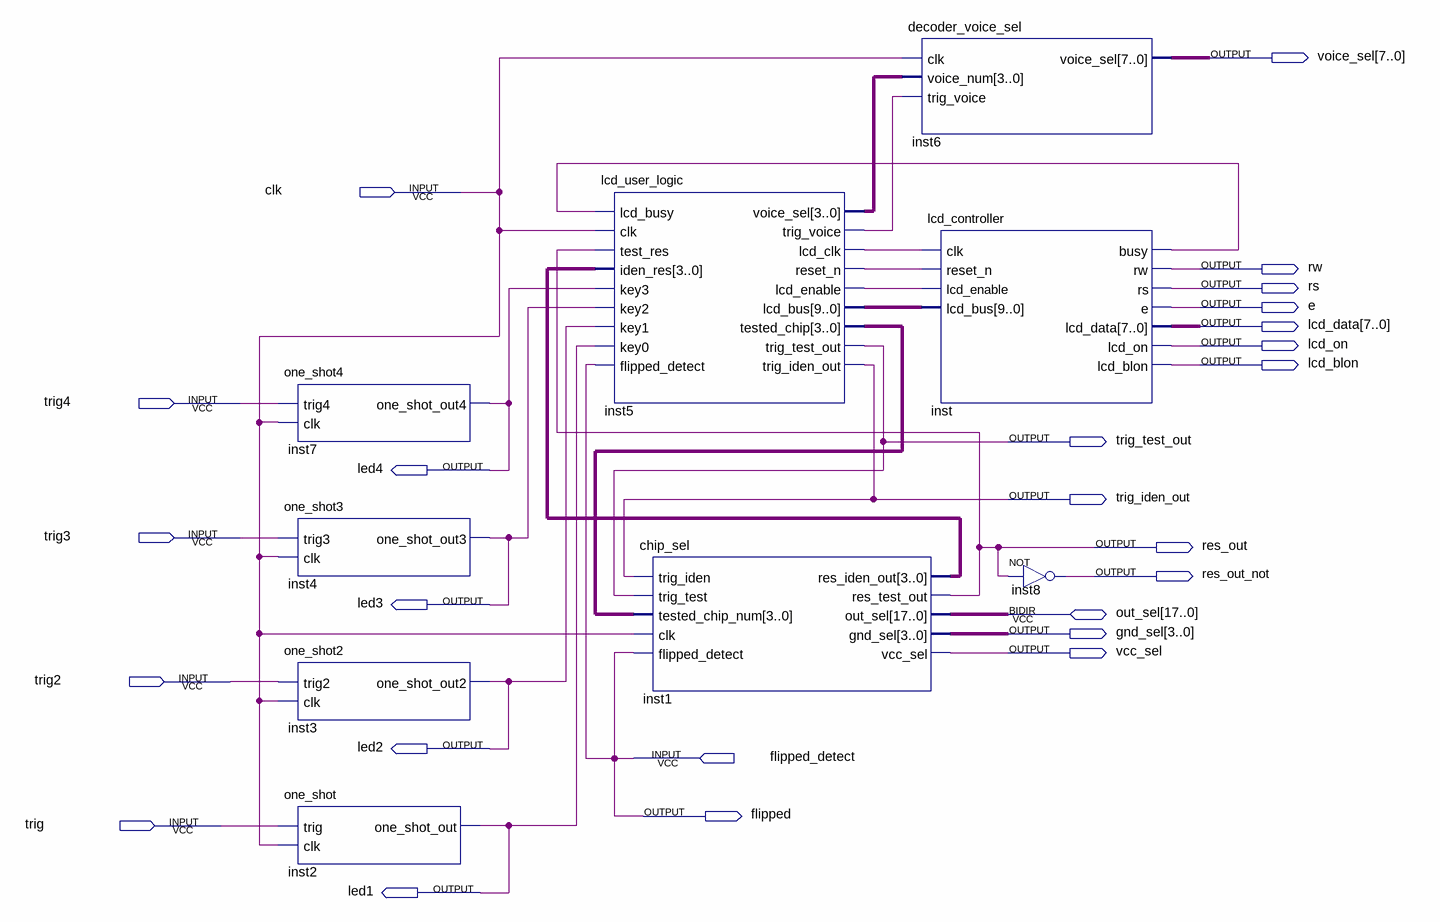
[diagram p0: schematic sheet]
// Quartus schematic final_project.bdf as structural Verilog: 9 symbols, 25 pins
module final_project (
  input  clk,
  input  trig4,
  input  trig3,
  input  trig2,
  input  flipped_detect,
  input  trig,
  inout  [17:0] out_sel,
  output [7:0] voice_sel,
  output rw,
  output rs,
  output e,
  output [7:0] lcd_data,
  output lcd_on,
  output lcd_blon,
  output trig_test_out,
  output led4,
  output trig_iden_out,
  output res_out,
  output res_out_not,
  output led3,
  output [3:0] gnd_sel,
  output vcc_sel,
  output led2,
  output flipped,
  output led1
);

  wire inst5_lcd_clk, inst5_lcd_enable, inst5_reset_n, inst5_trig_voice, inst_busy;
  wire [3:0] inst1_res_iden_out, inst5_tested_chip, inst5_voice_sel;
  wire [9:0] inst5_lcd_bus;

  one_shot4 inst7 (.trig4(trig4), .clk(clk), .one_shot_out4(led4));
  one_shot3 inst4 (.trig3(trig3), .clk(clk), .one_shot_out3(led3));
  one_shot2 inst3 (.trig2(trig2), .clk(clk), .one_shot_out2(led2));
  one_shot inst2 (.trig(trig), .clk(clk), .one_shot_out(led1));
  lcd_user_logic inst5 (
    .lcd_busy(inst_busy), .clk(clk), .test_res(res_out), .iden_res(inst1_res_iden_out), .key3(led4),
    .key2(led3), .key1(led2), .key0(led1), .flipped_detect(flipped_detect), .voice_sel(inst5_voice_sel),
    .trig_voice(inst5_trig_voice), .lcd_clk(inst5_lcd_clk), .reset_n(inst5_reset_n),
    .lcd_enable(inst5_lcd_enable), .lcd_bus(inst5_lcd_bus), .tested_chip(inst5_tested_chip),
    .trig_test_out(trig_test_out), .trig_iden_out(trig_iden_out));
  chip_sel inst1 (
    .trig_iden(trig_iden_out), .trig_test(trig_test_out), .tested_chip_num(inst5_tested_chip), .clk(clk),
    .flipped_detect(flipped_detect), .res_iden_out(inst1_res_iden_out), .res_test_out(res_out),
    .vcc_sel(vcc_sel), .out_sel(out_sel), .gnd_sel(gnd_sel));
  decoder_voice_sel inst6 (
    .clk(clk), .voice_num(inst5_voice_sel), .trig_voice(inst5_trig_voice), .voice_sel(voice_sel));
  lcd_controller inst (
    .clk(inst5_lcd_clk), .reset_n(inst5_reset_n), .lcd_enable(inst5_lcd_enable), .lcd_bus(inst5_lcd_bus),
    .busy(inst_busy), .rw(rw), .rs(rs), .e(e), .lcd_data(lcd_data), .lcd_on(lcd_on), .lcd_blon(lcd_blon));
  not inst8 (res_out_not, res_out);

  assign flipped = flipped_detect;
endmodule
